# Altium schematic sheet OECU_BASE1.SchDoc
size A4; SheetNumber: 1; SheetTotal: 6
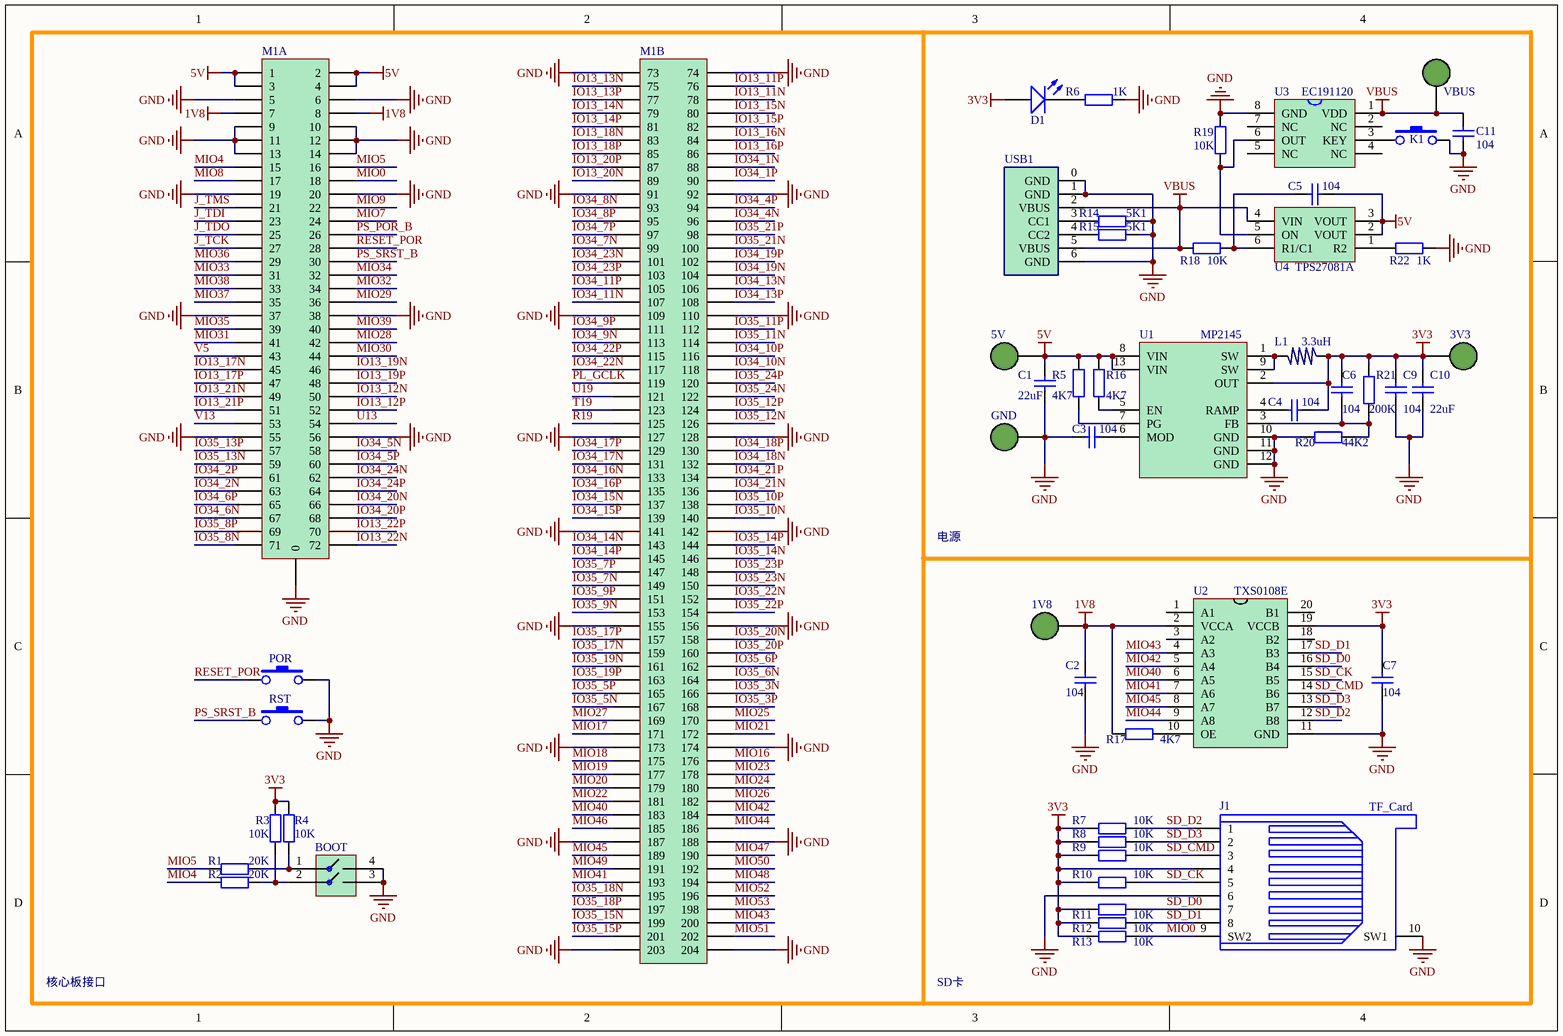
[diagram p0: OECU_BASE1.SchDoc]

## Parts
1V8  TEST_POINT_2mm  [TEST_POINT_2mm]  (value not drawn)
3V3  TEST_POINT_2mm  [TEST_POINT_2mm]  (value not drawn)
5V  TEST_POINT_2mm  [TEST_POINT_2mm]  (value not drawn)
BOOT  DIP_SWITCH_2.54_2_SMD_S  [DIP_SWITCH_2.54_2_SMD_S]  (value not drawn)
C1  22uF  [1206]
C2  104  [0402]
C3  104  [0402]
C4  104  [0402]
C5  104  [0402]
C6  104  [0402]
C7  104  [0402]
C9  104  [0402]
C10  22uF  [1206]
C11  104  [0402]
D1  LED  [LED_0603]  (value not drawn)
GND  TEST_POINT_2mm  [TEST_POINT_2mm]  (value not drawn)
J1  TF_Card  [TF_card]
K1  KEY  [KEY_DIP_6_L]  (value not drawn)
L1  3.3uH  [L_0420]
M1  DDR3_204P_H8  [DDR3_204P_H8]  (value not drawn)  (parts A,B of 2)
POR  KEY  [KEY_DIP_6_L]  (value not drawn)
R1  20K  [R_0402]
R2  20K  [R_0402]
R3  10K  [R_0402]
R4  10K  [R_0402]
R5  4K7  [R_0402]
R6  1K  [R_0402]
R7  10K  [R_0402]
R8  10K  [R_0402]
R9  10K  [R_0402]
R10  10K  [R_0402]
R11  10K  [R_0402]
R12  10K  [R_0402]
R13  10K  [R_0402]
R14  5K1  [R_0402]
R15  5K1  [R_0402]
R16  4K7  [R_0402]
R17  4K7  [R_0402]
R18  10K  [R_0402]
R19  10K  [R_0402]
R20  44K2  [R_0402]
R21  200K  [R_0402]
R22  1K  [R_0402]
RST  KEY  [KEY_DIP_6_L]  (value not drawn)
U1  MP2145  [QFN12]
U2  TXS0108E  [TSSOP20]
U3  EC191120  [SOP8-150MIL]
U4  TPS27081A  [SOT_23_6]
USB1  USB_C_6P  [USB_C_6PIN]  (value not drawn)
VBUS  TEST_POINT_2mm  [TEST_POINT_2mm]  (value not drawn)

## Nets
1V8: 1V8.1 C2.2 M1.7 M1.8 R17.1 U2.2(VCCA)
3V3: 3V3.1 C4.2 C6.2 C7.2 C9.2 C10.2 D1.A J1.4 L1.1 R3.2 R4.2 R7.1 R8.1 R9.1 R10.1 R11.1 R12.1 R13.1 R21.2 U1.2(OUT) U2.19(VCCB)
5V: 5V.1 C1.2 C5.1 M1.1 M1.2 M1.3 M1.4 R5.2 R16.2 U1.8(VIN) U1.13(VIN) U4.2(VOUT) U4.3(VOUT)
GND: BOOT.3 BOOT.4 C1.1 C2.1 C3.2 C7.1 C9.1 C10.1 C11.2 GND.1 J1.6 J1.10(SW1) K1.1 M1.0 M1.5 M1.6 M1.9 M1.10 M1.11 M1.12 M1.13 M1.14 M1.19 M1.20 M1.37 M1.38 M1.55 M1.56 M1.73 M1.74 M1.91 M1.92 M1.109 M1.110 M1.127 M1.128 M1.141 M1.142 M1.155 M1.156 M1.173 M1.174 M1.187 M1.188 M1.203 M1.204 POR.1 R6.2 R14.1 R15.1 R19.2 R20.2 R22.2 RST.1 U1.10(GND) U1.11(GND) U1.12(GND) U2.11(GND) U3.8(GND) USB1.0(GND) USB1.1(GND) USB1.6(GND)
VBUS: C11.1 R18.2 U3.1(VDD) U4.4(VIN) USB1.2(VBUS) USB1.5(VBUS) VBUS.1
IO13_11N: M1.78
IO13_11P: M1.76
IO13_12N: M1.50
IO13_12P: M1.52
IO13_13N: M1.75
IO13_13P: M1.77
IO13_14N: M1.79
IO13_14P: M1.81
IO13_15N: M1.80
IO13_15P: M1.82
IO13_16N: M1.84
IO13_16P: M1.86
IO13_17N: M1.45
IO13_17P: M1.47
IO13_18N: M1.83
IO13_18P: M1.85
IO13_19N: M1.46
IO13_19P: M1.48
IO13_20N: M1.89
IO13_20P: M1.87
IO13_21N: M1.49
IO13_21P: M1.51
IO13_22N: M1.72
IO13_22P: M1.70
IO34_1N: M1.88
IO34_1P: M1.90
IO34_2N: M1.63
IO34_2P: M1.61
IO34_4N: M1.96
IO34_4P: M1.94
IO34_5N: M1.58
IO34_5P: M1.60
IO34_6N: M1.67
IO34_6P: M1.65
IO34_7N: M1.99
IO34_7P: M1.97
IO34_8N: M1.93
IO34_8P: M1.95
IO34_9N: M1.113
IO34_9P: M1.111
IO34_10N: M1.118
IO34_10P: M1.116
IO34_11N: M1.107
IO34_11P: M1.105
IO34_13N: M1.106
IO34_13P: M1.108
IO34_14N: M1.143
IO34_14P: M1.145
IO34_15N: M1.137
IO34_15P: M1.139
IO34_16N: M1.133
IO34_16P: M1.135
IO34_17N: M1.131
IO34_17P: M1.129
IO34_18N: M1.132
IO34_18P: M1.130
IO34_19N: M1.104
IO34_19P: M1.102
IO34_20N: M1.66
IO34_20P: M1.68
IO34_21N: M1.136
IO34_21P: M1.134
IO34_22N: M1.117
IO34_22P: M1.115
IO34_23N: M1.101
IO34_23P: M1.103
IO34_24N: M1.62
IO34_24P: M1.64
IO35_3N: M1.166
IO35_3P: M1.168
IO35_5N: M1.167
IO35_5P: M1.165
IO35_6N: M1.164
IO35_6P: M1.162
IO35_7N: M1.149
IO35_7P: M1.147
IO35_8N: M1.71
IO35_8P: M1.69
IO35_9N: M1.153
IO35_9P: M1.151
IO35_10N: M1.140
IO35_10P: M1.138
IO35_11N: M1.114
IO35_11P: M1.112
IO35_12N: M1.126
IO35_12P: M1.124
IO35_13N: M1.59
IO35_13P: M1.57
IO35_14N: M1.146
IO35_14P: M1.144
IO35_15N: M1.199
IO35_15P: M1.201
IO35_17N: M1.159
IO35_17P: M1.157
IO35_18N: M1.195
IO35_18P: M1.197
IO35_19N: M1.161
IO35_19P: M1.163
IO35_20N: M1.158
IO35_20P: M1.160
IO35_21N: M1.100
IO35_21P: M1.98
IO35_22N: M1.152
IO35_22P: M1.154
IO35_23N: M1.150
IO35_23P: M1.148
IO35_24N: M1.122
IO35_24P: M1.120
J_TCK: M1.27
J_TDI: M1.23
J_TDO: M1.25
J_TMS: M1.21
MIO0: J1.9(SW2) M1.18 R13.2
MIO4: M1.15 R2.2
MIO5: M1.16 R1.2
MIO7: M1.24
MIO8: M1.17
MIO9: M1.22
MIO16: M1.176
MIO17: M1.171
MIO18: M1.175
MIO19: M1.177
MIO20: M1.179
MIO21: M1.172
MIO22: M1.181
MIO23: M1.178
MIO24: M1.180
MIO25: M1.170
MIO26: M1.182
MIO27: M1.169
MIO28: M1.42
MIO29: M1.36
MIO30: M1.44
MIO31: M1.41
MIO32: M1.34
MIO33: M1.31
MIO34: M1.32
MIO35: M1.39
MIO36: M1.29
MIO37: M1.35
MIO38: M1.33
MIO39: M1.40
MIO40: M1.183 U2.6(A5)
MIO41: M1.193 U2.7(A6)
MIO42: M1.184 U2.5(A4)
MIO43: M1.200 U2.4(A3)
MIO44: M1.186 U2.9(A8)
MIO45: M1.189 U2.8(A7)
MIO46: M1.185
MIO47: M1.190
MIO48: M1.194
MIO49: M1.191
MIO50: M1.192
MIO51: M1.202
MIO52: M1.196
MIO53: M1.198
PL_GCLK: M1.119
PS_POR_B: M1.26
PS_SRST_B: M1.30 RST.2
R19: M1.125
RESET_POR: M1.28 POR.2
SD_CK: J1.5 R10.2 U2.15(B5)
SD_CMD: J1.3 R9.2 U2.14(B6)
SD_D0: J1.7 R11.2 U2.16(B4)
SD_D1: J1.8 R12.2 U2.17(B3)
SD_D2: J1.1 R7.2 U2.12(B8)
SD_D3: J1.2 R8.2 U2.13(B7)
T19: M1.123
U13: M1.54
U19: M1.121
V5: M1.43
V13: M1.53
NetBOOT_1: BOOT.1 R1.1 R4.1
NetBOOT_2: BOOT.2 R2.1 R3.1
NetC3_1: C3.1 U1.6(MOD)
NetC4_1: C4.1 U1.4(RAMP)
NetC5_2: C5.2 R18.1 U4.6(R1/C1)
NetC6_1: C6.1 R20.1 R21.1 U1.3(FB)
NetD1_K: D1.K R6.1
NetK1_2: K1.2 U3.3(KEY)
NetL1_2: L1.2 U1.1(SW) U1.9(SW)
NetR5_1: R5.1 U1.7(PG)
NetR14_2: R14.2 USB1.3(CC1)
NetR15_2: R15.2 USB1.4(CC2)
NetR16_1: R16.1 U1.5(EN)
NetR17_2: R17.2 U2.10(OE)
NetR19_1: R19.1 U3.6(OUT) U4.5(ON)
NetR22_1: R22.1 U4.1(R2)

Not connected (* = marked no-connect by the designer): U2 1(A1) 3(A2) 18(B2) 20(B1); U3 2(NC) 4(NC) 5(NC) 7(NC)

## Notes on the sheet
- 电源
- 核心板接口
- SD卡

## Library data of the parts
BOOT = DIP_SWITCH_2.54_2_SMD_S: 双路贴片立式拨码开关
C1 C10 = CAP_1206: 贴片电容 1206
C2-C7 C9 C11 = CAP_0402: 贴片电容 0402
D1 = LED_0603: LED 0603
J1 = TF_Card: TF卡座
K1 POR RST = KEY_DIP_6_L: 直插卧式按键 6mm
L1 = L_0420: 电感 0420
R1-R22 = RES_0402: 电阻 0402
U1 = MP2145: 5.5V, 6A, 1.2MHz
U3 = EC191120: 长按2秒开关机
U4 = TPS27081A: 高侧负载开关